# Altium schematic sheet boost.SchDoc
size A4; SheetNumber: 4; SheetTotal: 4
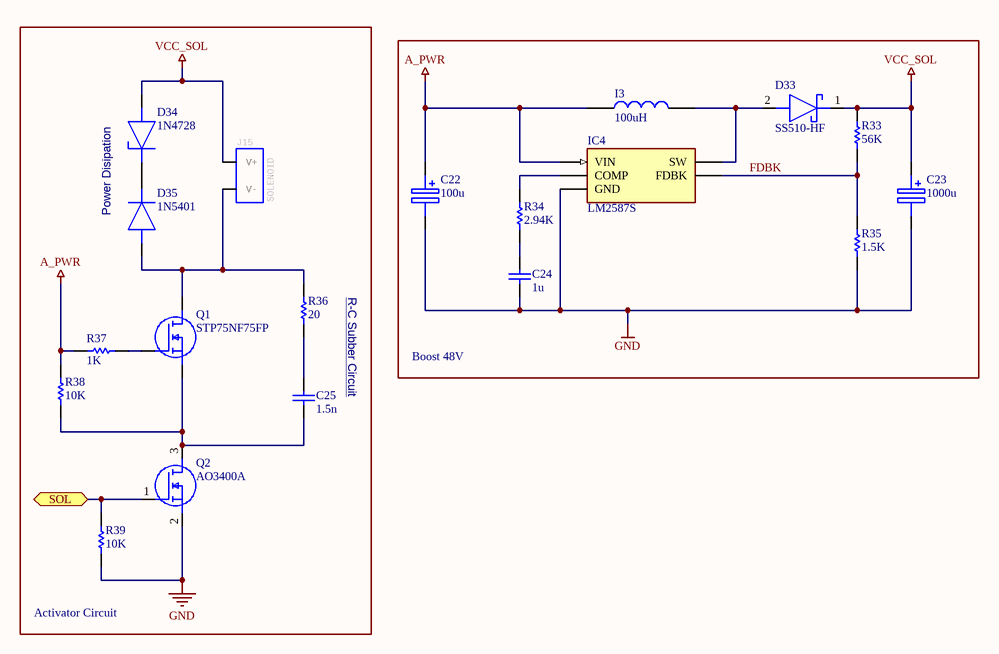
[diagram p0: boost.SchDoc]

## Parts
C22  100u  [100UF 10x10.5-Footprint-1]
C23  1000u  [CAPTHT1000UF]
C24  1u  [CAP0603]
C25  1.5n  [CAP0603]
D33  SS510-HF  [DIOM5025X220N]
D34  1N4728  [1N4728]
D35  1N5401  [1N5401]
I3  100uH  [SWPA8040]
IC4  LM2587S  [TO170P1435X465-6N]
J15  SOLENOID  [XT30PB-F]
Q1  STP75NF75FP  [TO255P460X1020X2030-3P]
Q2  AO3400A  [SOT95P280X125-3N]
R33  56K  [RES0603]
R34  2.94K  [RES0603]
R35  1.5K  [RES0603]
R36  20  [RES0603]
R37  1K  [RES0603]
R38  10K  [RES0603]
R39  10K  [RES0603]

## Blocks framed on the sheet
Boost 48V: C22-C24 D33 I3 IC4 R33-R35

## Ports
SOL (bidir)

## Nets
A_PWR: C22.1(+) I3.1 IC4.5(VIN) R37.2 R38.1
GND: C22.2(-) C23.2(-) C24.1 IC4.3,6(GND) Q2.2(S) R35.1 R39.2
VCC_SOL: C23.1(+) D33.1(K) D34.2 J15.+(V+) R33.2
FDBK: IC4.2(FDBK) R33.1 R35.2
SOL: Q2.1(G) R39.1 ; port SOL
NetC24_2: C24.2 R34.1
NetC25_1: C25.1 Q1.3(S) Q2.3(D) R38.2
NetC25_2: C25.2 R36.1
NetD33_2: D33.2(A) I3.2 IC4.4(SW)
NetD34_1: D34.1 D35.1
NetD35_2: D35.2 J15.-(V-) Q1.2(D) R36.2
NetIC4_1: IC4.1(COMP) R34.2
NetQ1_1: Q1.1(G) R37.1

## Notes on the sheet
- Power Disipation
- R-C Subber Circuit <https://en.wikipedia.org/wiki/Snubber#RC_snubbers>
- Activator Circuit

## Library data of the parts
C22 = CMP-001-00009-3: 100UF PANASONIC D; Value: 100u
C23 = 1000UF CAP: 1000UF
C24 C25 = CAP0603: 0603 Capacitor
D33 = SS510-HF: Schottky Diode; Manufacturer_Name: Comchip Technology; Datasheet Link: https://www.comchiptech.com/admin/files/product/20190806165140.pdf; Height: 2.2mm; Manufacturer_Part_Number: SS510-HF; Mouser Part Number: 750-SS510-HF; Mouser Price/Stock: https://www.mouser.co.uk/ProductDetail/Comchip-Technology/SS510-HF?qs=GBLSl2AkirsMVpU1ZRGkfw%3D%3D; Arrow Part Number: SS510-HF; Arrow Price/Stock: https://www.arrow.com/en/products/ss510-hf/comchip-technology?region=nac
D34 = 1N4728: Zener Diode
D35 = 1N5401: Rectifier Diode
I3 = SWPA8040: 10uH INDUCTOR
IC4 = LM2587S-ADJ_NOPB: Integrated Circuit; Manufacturer_Name: Texas Instruments; Manufacturer_Part_Number: LM2587S-ADJ/NOPB; Datasheet Link: http://www.ti.com/lit/ds/symlink/lm2587.pdf; Height: 4.65mm; Mouser Part Number: 926-LM2587S-ADJ/NOPB; Mouser Price/Stock: https://www.mouser.co.uk/ProductDetail/Texas-Instruments/LM2587S-ADJ-NOPB?qs=X1J7HmVL2ZEPViE%252BXoggZw%3D%3D; Arrow Part Number: LM2587S-ADJ/NOPB; Arrow Price/Stock: https://www.arrow.com/en/products/lm2587s-adjnopb/texas-instruments?region=nac
J15 = XT30PB-F
Q1 = CMP-096-000001-2: STMICROELECTRONICS - STP75NF75FP - MOSFET; Mouser Part Number: 511-STP75NF75FP; Mouser Price/Stock: https://www.mouser.co.uk/ProductDetail/STMicroelectronics/STP75NF75FP?qs=NCG0bTVqH4fdWmXBA4jGxA%3D%3D; Manufacturer_Part_Number: STP75NF75FP; Source: SamacSys.SchLib; Arrow Price/Stock: https://www.arrow.com/en/products/stp75nf75fp/stmicroelectronics; Datasheet Link: https://www.st.com/resource/en/datasheet/stp75nf75fp.pdf; Design Item ID: STP75NF75FP; Manufacturer_Name: STMicroelectronics; Height: 4.6mm; Arrow Part Number: STP75NF75FP
Q2 = AO3400A: MOSFET (N-Channel); Manufacturer_Name: Alpha & Omega Semiconductors; Datasheet Link: http://aosmd.com/res/data_sheets/AO3400A.pdf; Height: 1.25mm; Manufacturer_Part_Number: AO3400A; Arrow Part Number: AO3400A; Arrow Price/Stock: https://www.arrow.com/en/products/ao3400a/alpha-and-omega-semiconductor?region=europe
R33-R39 = RES0603: Resistor